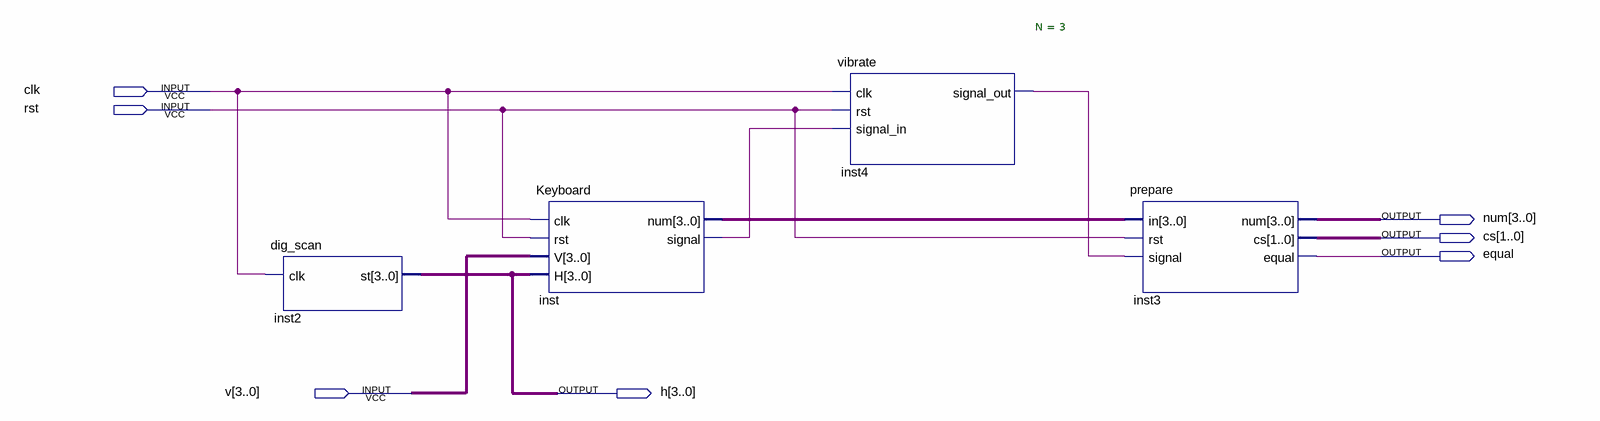
[diagram p0: schematic sheet]
// Quartus schematic keyscan.bdf as structural Verilog: 4 symbols, 7 pins
module keyscan (
  input  clk,
  input  rst,
  input  [3:0] v,
  output [3:0] num,
  output [1:0] cs,
  output equal,
  output [3:0] h
);

  wire inst4_signal_out, inst_signal;
  wire [3:0] inst_num;

  dig_scan inst2 (.clk(clk), .st(h));
  Keyboard inst (.clk(clk), .rst(rst), .V(v), .H(h), .num(inst_num), .signal(inst_signal));
  vibrate #(.N(3)) inst4 (.clk(clk), .rst(rst), .signal_in(inst_signal), .signal_out(inst4_signal_out));
  prepare inst3 (.in(inst_num), .rst(rst), .signal(inst4_signal_out), .num(num), .cs(cs), .equal(equal));
endmodule
